# EAGLE schematic bus (EAGLE 7.7.0)
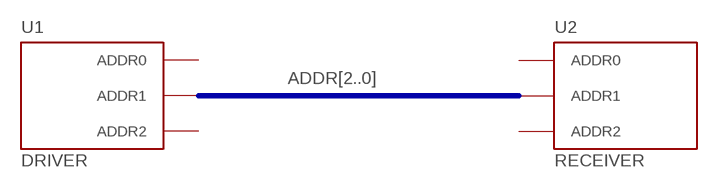
[diagram p0: schematic, sheet 1]

## Parts
U1  DRIVER  DRIVER3  (no package)
U2  RECEIVER  RECEIVER3  (no package)
Unconnected: U1.ADDR0 U1.ADDR1 U1.ADDR2 U2.ADDR0 U2.ADDR1 U2.ADDR2

## Buses
ADDR[2..0]

## Library data of the parts
U1 = generic:DRIVER3
U2 = generic:RECEIVER3